# Altium schematic sheet MCU_v2.SchDoc
size Letter; DrawnBy: Robson Souza; SheetNumber: 9; SheetTotal: 9
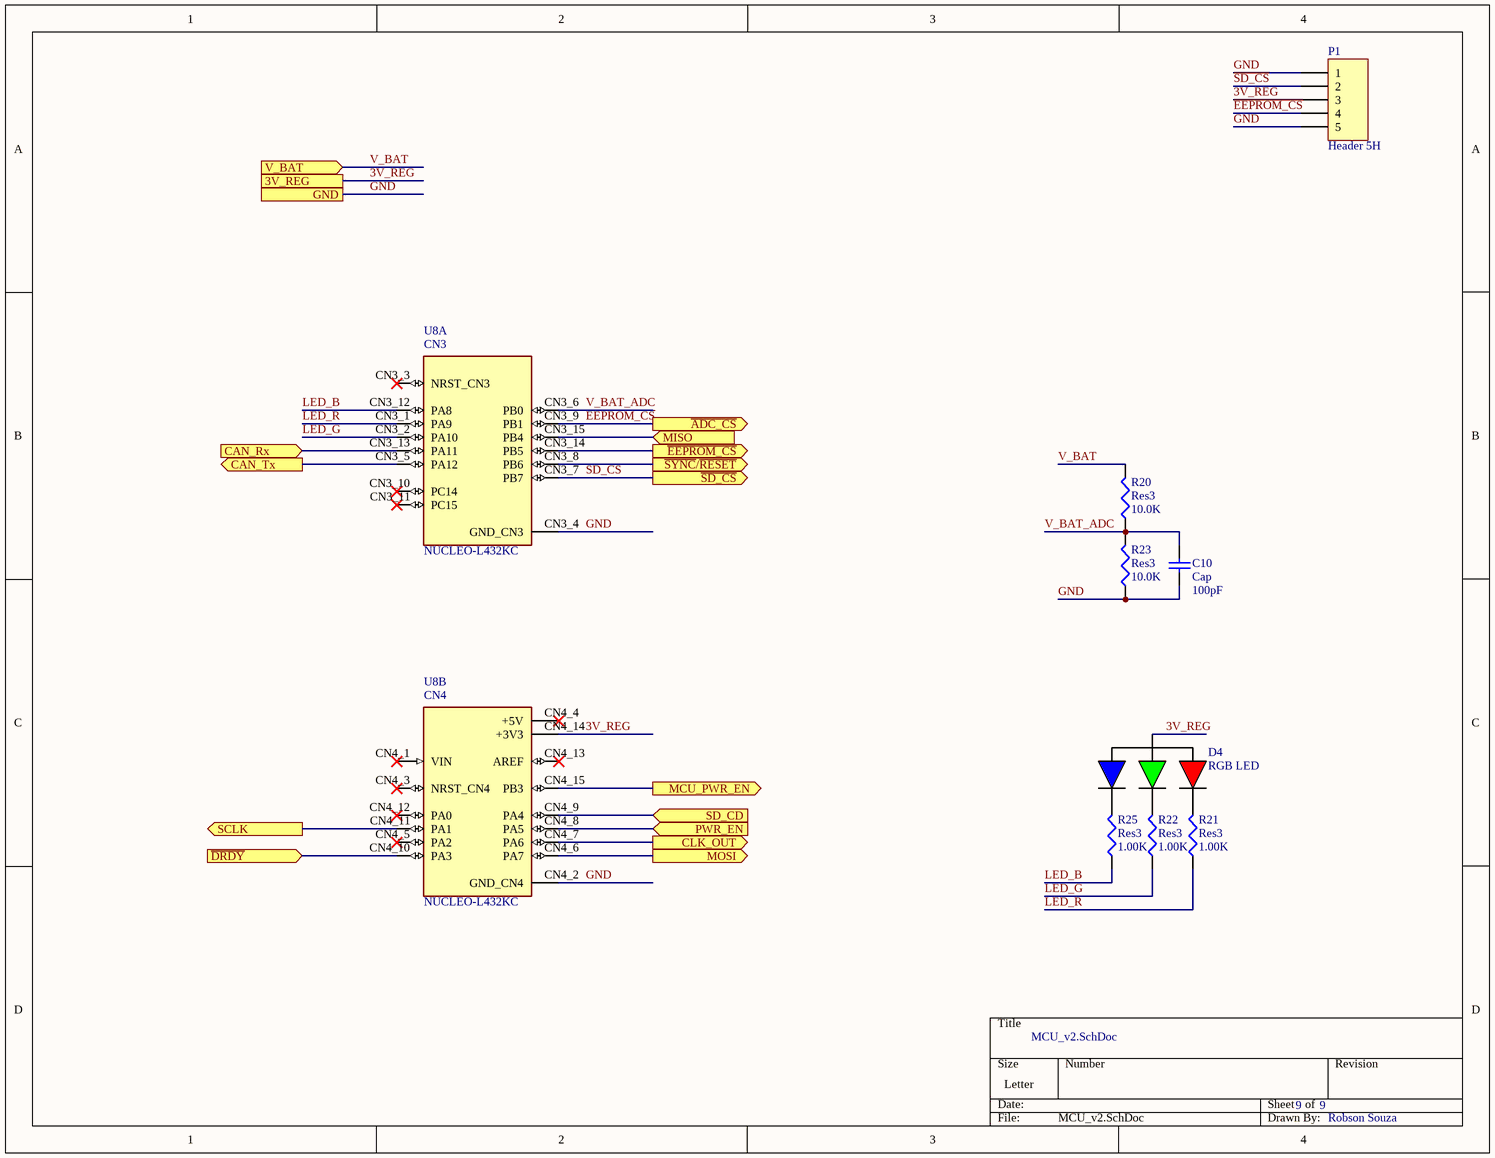
[diagram p0: MCU_v2.SchDoc]

## Parts
C10  Cap  value 100pF  [CAPC2012X09M]
D4  RGB LED  [SML-LX0303RGBC1TR]
P1  Header 5H  [HDR1X5H]
R20  Res3  value 10.0K  [RESC2112X05M]
R21  Res3  value 1.00K  [RESC2112X05M]
R22  Res3  value 1.00K  [RESC2112X05M]
R23  Res3  value 10.0K  [RESC2112X05M]
R25  Res3  value 1.00K  [RESC2112X05M]
U8  NUCLEO-L432KC  [MODULE_NUCLEO-L432KC]  (parts A,B of 2)

## Ports
3V_REG, CAN_Rx (in), CAN_Tx (out), CLK_OUT (out), GND, MCU_PWR_EN (out), MISO (in), MOSI (out), PWR_EN (in), SCLK (out), SD_CD (in), V_BAT (in), ~{ADC_CS} (out), ~{DRDY} (in), ~{EEPROM_CS} (out), ~{SD_CS} (out), ~{SYNC}/~{RESET} (out)

## Nets
3V_REG: D4.1 P1.3 U8.CN4_14(+3V3) ; port 3V_REG
CAN_Rx: U8.CN3_13(PA11) ; port CAN_Rx
CAN_Tx: U8.CN3_5(PA12) ; port CAN_Tx
CLK_OUT: U8.CN4_7(PA6) ; port CLK_OUT
~{DRDY}: U8.CN4_10(PA3) ; port ~{DRDY}
~{EEPROM_CS}: P1.4 U8.CN3_9(PB1) ; port ~{ADC_CS}
~{EEPROM_CS}: U8.CN3_14(PB5) ; port ~{EEPROM_CS}  [a separate net that carries the same name]
GND: C10.1 P1.1 P1.5 R23.1 U8.CN3_4(GND_CN3) U8.CN4_2(GND_CN4) ; port GND
LED_B: R25.1 U8.CN3_12(PA8)
LED_G: R22.1 U8.CN3_2(PA10)
LED_R: R21.1 U8.CN3_1(PA9)
MCU_PWR_EN: U8.CN4_15(PB3) ; port MCU_PWR_EN
MISO: U8.CN3_15(PB4) ; port MISO
MOSI: U8.CN4_6(PA7) ; port MOSI
PWR_EN: U8.CN4_8(PA5) ; port PWR_EN
~{SD_CS}: P1.2 U8.CN3_7(PB7) ; port ~{SD_CS}
~{SYNC}/~{RESET}: U8.CN3_8(PB6) ; port ~{SYNC}/~{RESET}
SCLK: U8.CN4_11(PA1) ; port SCLK
SD_CD: U8.CN4_9(PA4) ; port SD_CD
V_BAT: R20.2 ; port V_BAT
V_BAT_ADC: C10.2 R20.1 R23.2 U8.CN3_6(PB0)
NetD4_2: D4.2 R21.2
NetD4_3: D4.3 R22.2
NetD4_4: D4.4 R25.2

Not connected (* = marked no-connect by the designer): U8 CN3_3(NRST_CN3)* CN3_10(PC14)* CN3_11(PC15)* CN4_1(VIN)* CN4_3(NRST_CN4)* CN4_4(+5V)* CN4_5(PA2)* CN4_12(PA0)* CN4_13(AREF)*

## Notes on the sheet
- (in symbol NUCLEO-L432KC, part A) CN3
- (in symbol NUCLEO-L432KC, part B) CN4

## Library data of the parts
C10 = CAP-COG-100pF-500V-±5%: CAP CER 100pF 500v COG 0805; MPN: C0805C101JCGACTU; WV: 500; Tolerance: ±5%; PN: 399-5102-1-ND; Name: CAP-COG-100pF-500V-±5%; Type: COG; URL: http://www.digikey.ca/product-detail/en/C0805C101JCGACTU/399-5102-1-ND
D4 = SML-LX0303RGBC/1TR: MP: SML-LX0303RGBC/1TR
P1 = Header 5H: Header, 5-Pin, Right Angle; LatestRevisionDate: 17-Jul-2002; LatestRevisionNote: Re-released for DXP Platform.; Publisher: Altium Limited
R20 R23 = Resistor_10.0K: RES SMD 10.0K OHM 1% 1/8W 0805; MPN: CRCW080510K0FKEA; PN: 541-10.0KCCT-ND; Name: Resistor_10.0K; URL: http://www.digikey.ca/product-detail/en/CRCW080510K0FKEA/541-10.0KCCT-ND
R21 R22 R25 = Resistor_1.00K: RES SMD 1.00K OHM 1% 1/8W 0805; MPN: CRCW08051K00FKEA; PN: 541-1.00KCCT-ND; Name: Resistor_1.00K; URL: http://www.digikey.ca/product-detail/en/CRCW08051K00FKEA/541-1.00KCCT-ND
U8 = NUCLEO-L432KC: STM32 Nucleo-32 development board with STM32L432KC MCU, supports Arduino connectivity; Package: None; Price: None; Availability: Unavailable; MP: NUCLEO-L432KC; Value: *